# Altium schematic sheet Display.SchDoc: MSE - CSYEI : Dot matrix display
size A4; Author: Guillaume Volery; SheetNumber: 5; SheetTotal: 8; SVN: OUI; Version: 2.1; NoProject: <no>; TitleProject: <project>; PageSetup: Record=PageOptions|CenterHorizontal=True|CenterVertical=True|PrintScale=0.97|XCorrection=1.00|YCorrection=1.00|PrintKind=0|BorderSize=5000000|LeftOffset=0|BottomOffset=0|Orientation=2|PaperLength=1000|PaperWidth=1000|Scale=100|PaperSource=7|PrintQuality=-3|MediaType=1|DitherType=10|PrintScaleMode=1|PaperKind=A4 (210 x 297 mm)|PaperIndex=9
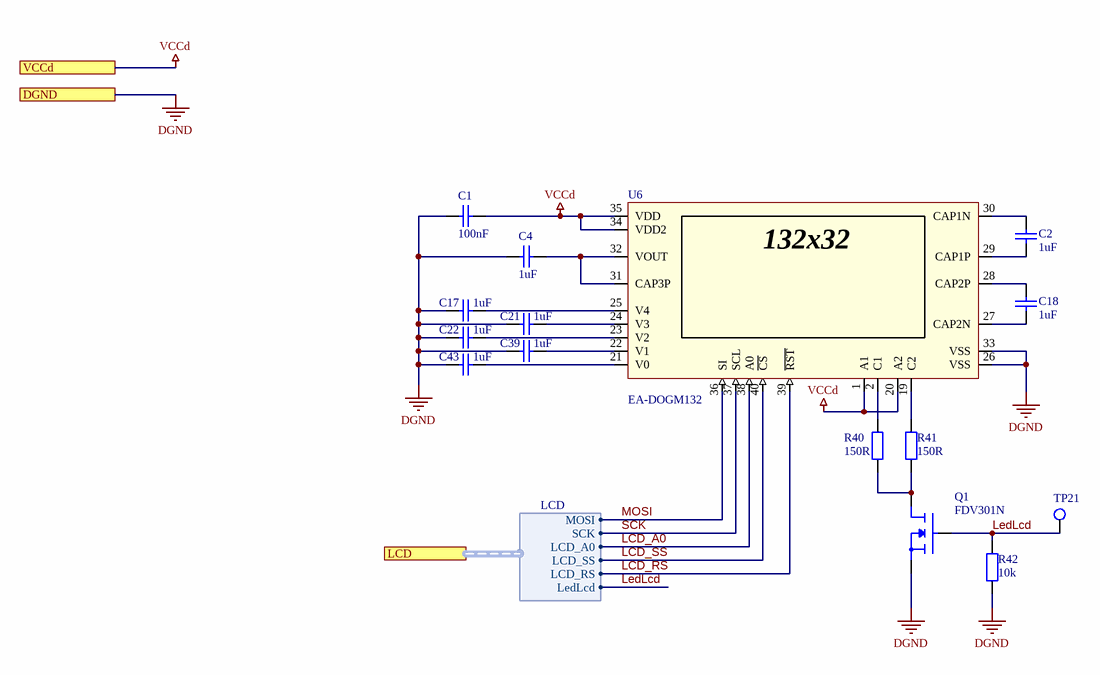
[diagram p0: Display.SchDoc]

## Parts
C1  100nF  [CAPC2012N]
C2  1uF  [CAPC2012N]
C4  1uF  [CAPC2012N]
C17  1uF  [CAPC2012N]
C18  1uF  [CAPC2012N]
C21  1uF  [CAPC2012N]
C22  1uF  [CAPC2012N]
C39  1uF  [CAPC2012N]
C43  1uF  [CAPC2012N]
Q1  FDV301N  [SOT23-3N]
R40  150R  [RESC2012N]
R41  150R  [RESC2012N]
R42  10k  [RESC2012N]
TP21  TP  [Testpoint]  (value not drawn)
U6  EA-DOGM132  [EA_DOGM132_WITH_BACKLIGHT]

## Ports
DGND, LCD (harness LCD), VCCd

## Harnesses
LCD: LCD_RS, LCD_SS, MOSI, SCK, LedLcd, LCD_A0

## Nets
DGND: C1.1 C4.1 C17.1 C21.1 C22.1 C39.1 C43.1 Q1.2(S) R42.1 U6.26(VSS) U6.33(VSS) ; port DGND
VCCd: C1.2 U6.1(A1) U6.20(A2) U6.34(VDD2) U6.35(VDD) ; port VCCd
LCD_A0: U6.38(A0) ; port LCD.LCD_A0
LCD_RS: U6.39(~{RST}) ; port LCD.LCD_RS
LCD_SS: U6.40(~{CS}) ; port LCD.LCD_SS
LedLcd: Q1.1(G) R42.2 TP21.1 ; port LCD.LedLcd
MOSI: U6.36(SI) ; port LCD.MOSI
SCK: U6.37(SCL) ; port LCD.SCK
NetC2_1: C2.1 U6.29(CAP1P)
NetC2_2: C2.2 U6.30(CAP1N)
NetC4_2: C4.2 U6.31(CAP3P) U6.32(VOUT)
NetC17_2: C17.2 U6.25(V4)
NetC18_1: C18.1 U6.27(CAP2N)
NetC18_2: C18.2 U6.28(CAP2P)
NetC21_2: C21.2 U6.24(V3)
NetC22_2: C22.2 U6.23(V2)
NetC39_2: C39.2 U6.22(V1)
NetC43_2: C43.2 U6.21(V0)
NetQ1_3: Q1.3(D) R40.1 R41.1
NetR40_2: R40.2 U6.2(C1)
NetR41_2: R41.2 U6.19(C2)

## Notes on the sheet
- Title
- Institut d'automatisation industrielle
  rte de Cheseaux 1
  CH-1401 Yverdon-les-Bains
  T +41(0)24 55 77 377    F +41(0)24 55 76 320
  http://iai.heig-vd.ch       iai@heig-vd.ch
- Date:
- Size:
- A4
- Project:
- Sheet
- of
- No.
- Author:
- SVN
- Version
- File:
- (in symbol DOGM_132-5) 132x32

## Library data of the parts
C1 = Cap_100nF: Capacitor; Value: 100nF; Supplier 1: Digi-Key; Supplier Part Number 1: 478-1395-1-ND
C2 C4 C17 C18 C21 C22 C39 C43 = Cap_1uF: Capacitor; Value: 1uF; Supplier 1: Digi-Key; Supplier Part Number 1: 490-10743-1-ND
R40 R41 = Res_150R: Resistor; Value: 150R; Supplier 1: Digi-Key; Supplier Part Number 1: 311-150CRCT-ND
R42 = Res_10k: Resistor; Value: 10k; Supplier 1: Digi-Key; Supplier Part Number 1: 311-10.0KCRCT-ND
TP21 = TP: =Value; Supplier 1: Digi-Key; Supplier Part Number 1: 36-5006-ND
U6 = DOGM_132-5: Chip On Glass Graphic LCD; Value: EA-DOGM132
Q1 = FDV301N: Value: FDV301N; Supplier 1: Digi-Key; Supplier Part Number 1: FDV301NCT-ND